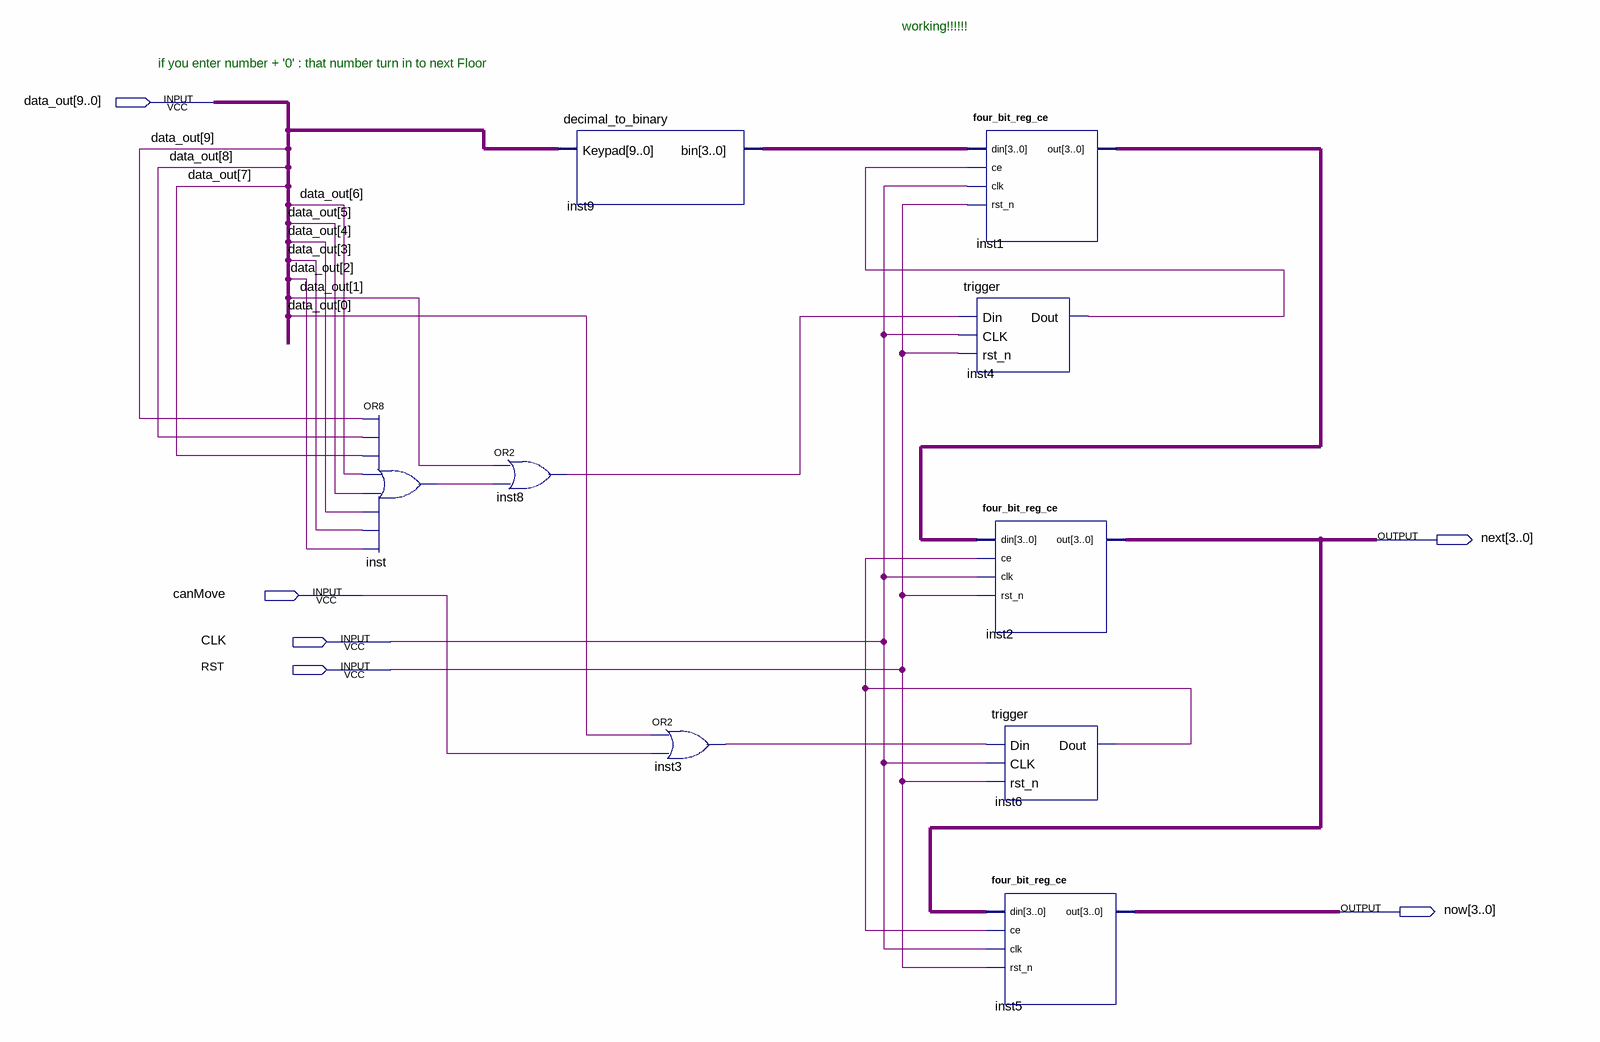
[diagram p0: schematic sheet]
// Quartus schematic keypad.bdf as structural Verilog: 9 symbols, 6 pins
module keypad (
  input  [9:0] data_out,
  input  canMove,
  input  CLK,
  input  RST,
  output [3:0] next,
  output [3:0] now
);

  wire inst3_out, inst4_dout, inst6_dout, inst8_out, inst_out;
  wire [3:0] inst1_out, inst9_bin;

  or inst (inst_out, data_out[9], data_out[8], data_out[7], data_out[6], data_out[5], data_out[4], data_out[3], data_out[2]);
  or inst8 (inst8_out, data_out[1], inst_out);
  decimal_to_binary inst9 (.Keypad(data_out), .bin(inst9_bin));
  or inst3 (inst3_out, data_out[0], canMove);
  four_bit_reg_ce inst1 (.din(inst9_bin), .ce(inst4_dout), .clk(CLK), .rst_n(RST), .out(inst1_out));
  trigger inst4 (.Din(inst8_out), .CLK(CLK), .rst_n(RST), .Dout(inst4_dout));
  four_bit_reg_ce inst2 (.din(inst1_out), .ce(inst6_dout), .clk(CLK), .rst_n(RST), .out(next));
  trigger inst6 (.Din(inst3_out), .CLK(CLK), .rst_n(RST), .Dout(inst6_dout));
  four_bit_reg_ce inst5 (.din(next), .ce(inst6_dout), .clk(CLK), .rst_n(RST), .out(now));

  // Notes on the sheet:
  //   working!!!!!!
  //   if you enter number + '0' : that number turn in to next Floor
endmodule
